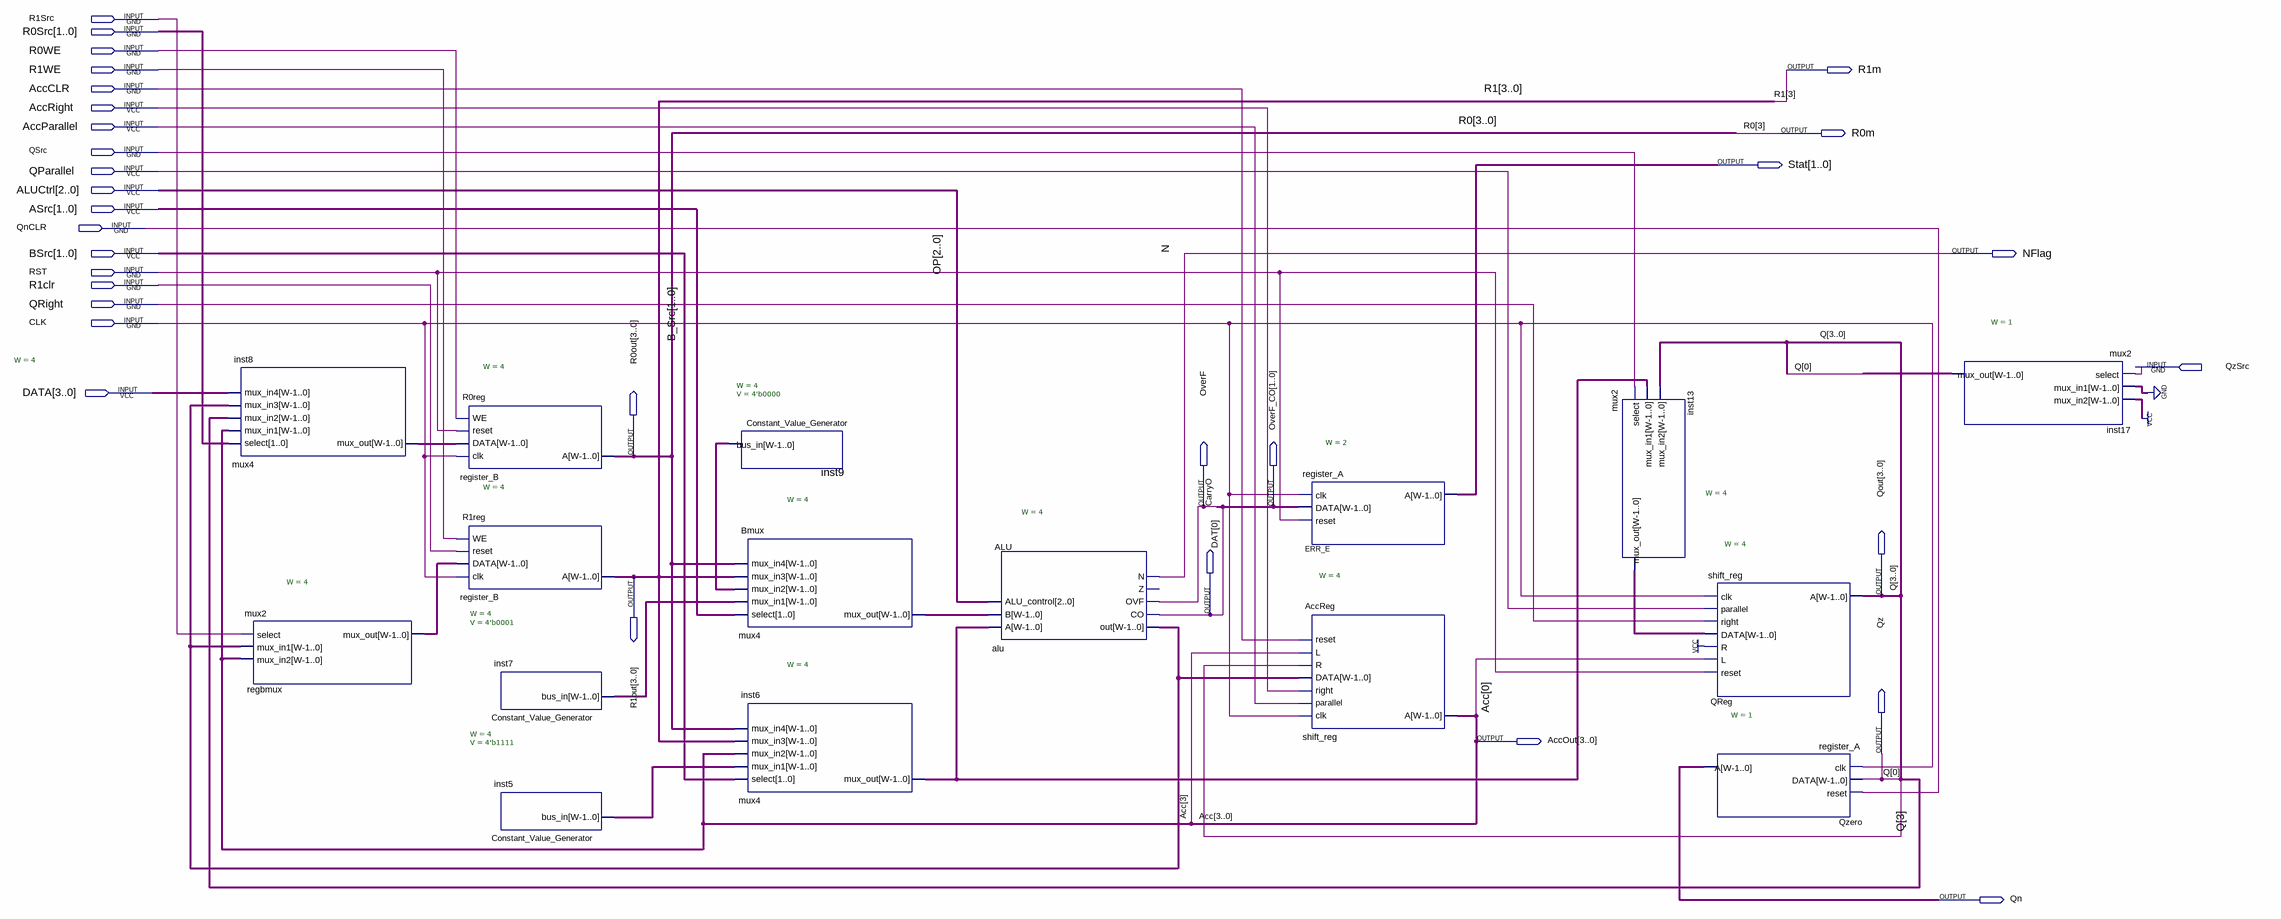
[diagram p0: schematic sheet]
// Quartus schematic ALP.bdf as structural Verilog: 16 symbols, 32 pins
module ALP (
  input  R1Src,
  input  [1:0] R0Src,
  input  R0WE,
  input  R1WE,
  input  AccCLR,
  input  AccRight,
  input  AccParallel,
  input  QSrc,
  input  QParallel,
  input  [2:0] ALUCtrl,
  input  [1:0] ASrc,
  input  QnCLR,
  input  [1:0] BSrc,
  input  RST,
  input  R1clr,
  input  QRight,
  input  CLK,
  input  QzSrc,
  input  [3:0] DATA,
  output R1m,
  output R0m,
  output [1:0] Stat,
  output NFlag,
  output [3:0] R0out,
  output OverF,
  output [1:0] OverF_CO,
  output [3:0] R1out,
  output [3:0] Qout,
  output CarryO,
  output [3:0] AccOut,
  output Qz,
  output Qn
);

  wire inst17_mux_out;
  wire [3:0] ALU_out, Bmux_mux_out, inst5_bus_in, inst6_mux_out, inst7_bus_in, inst8_mux_out, inst9_bus_in,
       inst13_mux_out, regbmux_mux_out;

  mux4 #(.W(4)) inst8 (
    .select(R0Src), .mux_in1(AccOut), .mux_in2(Qout), .mux_in3(ALU_out), .mux_in4(DATA),
    .mux_out(inst8_mux_out));
  mux2 #(.W(4)) regbmux (.select(R1Src), .mux_in1(ALU_out), .mux_in2(AccOut), .mux_out(regbmux_mux_out));
  register_B #(.W(4)) R0reg (.clk(CLK), .DATA(inst8_mux_out), .reset(RST), .WE(R0WE), .A({R0m, R0out[2:0]}));
  register_B #(.W(4)) R1reg (.clk(CLK), .DATA(regbmux_mux_out), .reset(R1clr), .WE(R1WE), .A({R1m, R1out[2:0]}));
  Constant_Value_Generator #(.W(4), .V(4'b0001)) inst7 (.bus_in(inst7_bus_in));
  Constant_Value_Generator #(.W(4), .V(4'b1111)) inst5 (.bus_in(inst5_bus_in));
  Constant_Value_Generator #(.W(4), .V(4'b0000)) inst9 (.bus_in(inst9_bus_in));
  mux4 #(.W(4)) Bmux (
    .select(ASrc), .mux_in1(inst7_bus_in), .mux_in2(inst9_bus_in), .mux_in3({R1m, R1out[2:0]}),
    .mux_in4({R0m, R0out[2:0]}), .mux_out(Bmux_mux_out));
  mux4 #(.W(4)) inst6 (
    .select(BSrc), .mux_in1(inst5_bus_in), .mux_in2(AccOut), .mux_in3({R1m, R1out[2:0]}),
    .mux_in4({R0m, R0out[2:0]}), .mux_out(inst6_mux_out));
  alu #(.W(4)) ALU (
    .A(inst6_mux_out), .B(Bmux_mux_out), .ALU_control(ALUCtrl), .out(ALU_out), .CO(CarryO), .OVF(OverF),
    .N(NFlag));  // open: Z
  register_A #(.W(2)) ERR_E (.clk(CLK), .DATA({OverF, CarryO}), .reset(RST), .A(Stat));
  shift_reg #(.W(4)) AccReg (
    .clk(CLK), .parallel(AccParallel), .right(AccRight), .DATA(ALU_out), .R(Qout[3]), .L(AccOut[3]),
    .reset(AccCLR), .A(AccOut));
  mux2 #(.W(4)) inst13 (.select(QSrc), .mux_in1(inst6_mux_out), .mux_in2(Qout), .mux_out(inst13_mux_out));
  shift_reg #(.W(4)) QReg (
    .DATA(inst13_mux_out), .L(AccOut[0]), .R(1'b1), .clk(CLK), .parallel(QParallel), .reset(RST),
    .right(QRight), .A(Qout));
  register_A #(.W(1)) Qzero (.DATA(Qout[0]), .clk(CLK), .reset(QnCLR), .A(Qn));
  mux2 #(.W(1)) inst17 (.select(QzSrc), .mux_in1(1'b0), .mux_in2(1'b1), .mux_out(inst17_mux_out));

  assign OverF_CO = {OverF, CarryO};
  assign Qz = Qout[0];
  assign R0out[3] = R0m;
  assign R1out[3] = R1m;

  // Other names for the same wires on the sheet: Acc[3:0] = AccOut; OP[2:0] = ALUCtrl; B_Src[1:0] = BSrc;
  //   DAT[1:0] = {OverF, CarryO}; N = NFlag; Q[3:0] = Qout; R0[3:0] = {R0m, R0out[2:0]}; R1[3:0] = {R1m, R1out[2:0]}
endmodule
